# EAGLE schematic BKU (EAGLE 9.4.2)
ESKD_DESCRIPTION1: 207|235|224|242|224|32|193|209|202|49; ESKD_DESCRIPTION2: 241|245|229|236|224|32|253|235|229|234|242|240|232|247|229|241|234|224|255; ESKD_DESCRIPTION3: 239|240|232|237|246|232|239|232|224|235|252|237|224|255; ESKD_NUMBER: 67|67|83|49|46|50|50|48|48|45|48|221|51; ESKD_NUMBER_SHEET: 49; ESKD_SHEETS: 49
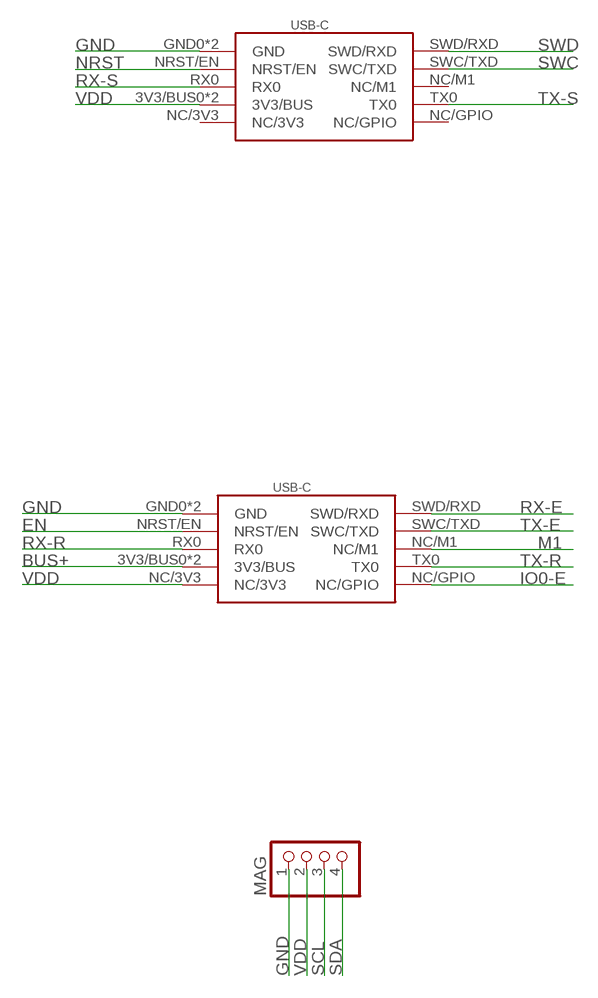
[diagram p0: schematic, sheet 1, part 1 of 2]
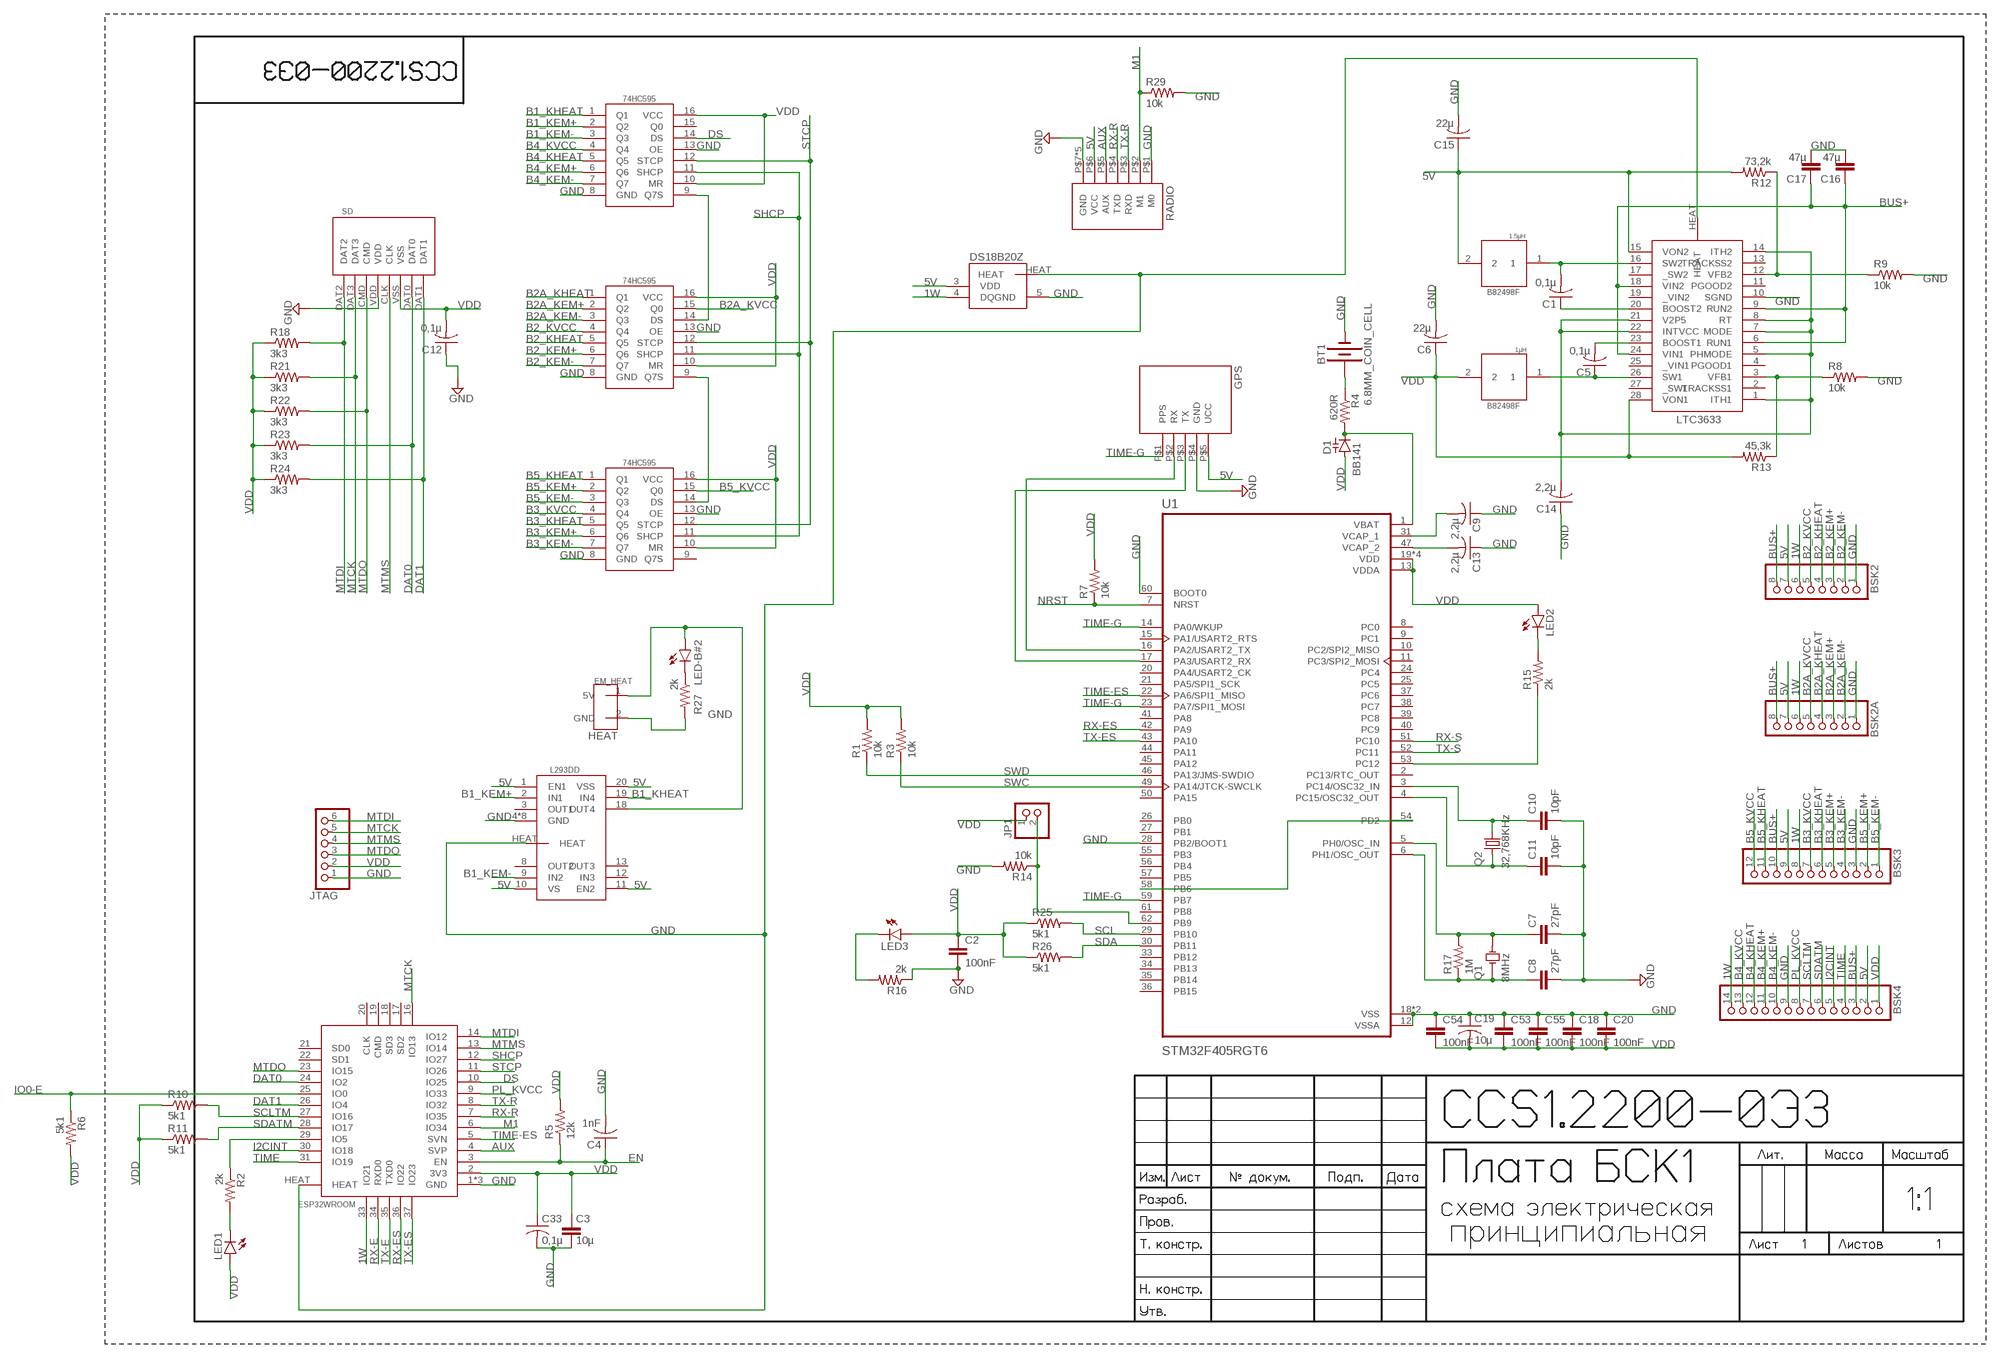
[diagram p1: schematic, sheet 1, part 2 of 2]

## Parts
BSK2  PINHD-1X8  [1X08]
BSK2A  PINHD-1X8  [1X08]
BSK3  PINHD-1X12  [1X12]
BSK4  PINHD-1X14  [1X14]
BT1  6.8MM_COIN_CELL  BATTERY-6.8MM_SMD  [BATTCON-6.8MM]
C1  0,1µ  C-USC0603  [C0603]
C2  100nF  C-EUC0603  [C0603]
C3  10µ  C-EUC1206  [C1206]
C4  1nF  C-USC0603  [C0603]
C5  0,1µ  C-USC0603  [C0603]
C6  22µ  C-USC1206  [C1206]
C7  27pF  C-EUC0603  [C0603]
C8  27pF  C-EUC0603  [C0603]
C9  2,2µ  C-USC0603  [C0603]
C10  10pF  C-EUC0603  [C0603]
C11  10pF  C-EUC0603  [C0603]
C12  0,1µ  C-USC0603  [C0603]
C13  2,2µ  C-USC0603  [C0603]
C14  2,2µ  C-USC0603  [C0603]
C15  22µ  C-USC1206  [C1206]
C16  47µ  C-EUC1210  [C1210]
C17  47µ  C-EUC1210  [C1210]
C18  100nF  C-EUC0603  [C0603]
C19  10µ  C-USC1206  [C1206]
C20  100nF  C-EUC0603  [C0603]
C33  0,1µ  C-USC0603  [C0603]
C53  100nF  C-EUC0603  [C0603]
C54  100nF  C-EUC0603  [C0603]
C55  100nF  C-EUC0603  [C0603]
D1  BB141  [SOD523]
GPS  GPSNEO6M  [GPS-NEO6M]
JP1  PINHD-1X2  [1X02]
JTAG  PINHD-1X6  [1X06]
LED1  LEDCHIPLED_0603  [CHIPLED_0603]
LED2  LEDCHIPLED_0603  [CHIPLED_0603]
LED3  LEDCHIPLED_0603  [CHIPLED_0603]
LED-B#2  LEDCHIPLED_0603  [CHIPLED_0603]
MAG  PINHD-1X4  [1X04]
Q1  8MHz  9C-8.000MEEJ-T  [XTAL_9C-8.000MEEJ-T]
Q2  32,768KHz  C005R  [C005R]
R1  10k  R-US_R0603  [R0603]
R2  2k  R-US_R0603  [R0603]
R3  10k  R-US_R0603  [R0603]
R4  620R  R-US_R0603  [R0603]
R5  12k  R-US_R0603  [R0603]
R6  5k1  R-US_R0603  [R0603]
R7  10k  R-US_R0603  [R0603]
R8  10k  R-US_R0603  [R0603]
R9  10k  R-US_R0603  [R0603]
R10  5k1  R-US_R0603  [R0603]
R11  5k1  R-US_R0603  [R0603]
R12  73,2k  R-US_R0603  [R0603]
R13  45,3k  R-US_R0603  [R0603]
R14  10k  R-US_R0603  [R0603]
R15  2k  R-US_R0603  [R0603]
R16  2k  R-US_R0603  [R0603]
R17  1M  R-US_R0603  [R0603]
R18  3k3  R-US_R0603  [R0603]
R21  3k3  R-US_R0603  [R0603]
R22  3k3  R-US_R0603  [R0603]
R23  3k3  R-US_R0603  [R0603]
R24  3k3  R-US_R0603  [R0603]
R25  5k1  R-US_R0603  [R0603]
R26  5k1  R-US_R0603  [R0603]
R27  2k  R-US_R0603  [R0603]
R29  10k  R-US_R0603  [R0603]
RADIO  RADIO  [RADIO]
SD  SD  [SD]
U1  STM32F405RGT6  [QFP50P1200X1200X160-64N]
U$4  USB-C  [USB-C]
U$5  DS18B20Z  [DS18B20Z]
U$6  USB-C  [USB-C]
U$7  EM_HEAT  [EM_HEAT]
U$8  L293DD  [L293DD]
U$10  LTC3633  [LTC3633]
U$11  1µH  B82498F  [B82498F]
U$12  B82498F  [B82498F]
U$13  ESP32WROOM  [ESP32WROOM]
U$18  74HC595  [74HC595]
U$19  74HC595  [74HC595]
U$20  74HC595  [74HC595]

## Nets
1W: BSK2.6 BSK2A.6 BSK3.8 BSK4.14 U$5.4(DQ) U$13.33(IO21)
5V: BSK2.7 BSK2A.7 BSK3.9 BSK4.2 C15.1 GPS.P$5(UCC) R12.2 RADIO.P$6(VCC) U$5.3(VDD) U$8.1(EN1) U$8.10(VS) U$8.11(EN2) U$8.20(VSS) U$10.15(VON2) U$12.2
AUX: RADIO.P$5(AUX) U$13.4(SVP)
B1_KEM+: U$8.2(IN1) U$18.2(Q2)
B1_KEM-: U$8.9(IN2) U$18.3(Q3)
B1_KHEAT: U$8.19(IN4) U$18.1(Q1)
B2_KEM+: BSK2.3 U$19.6(Q6)
B2_KEM-: BSK2.2 U$19.7(Q7)
B2_KHEAT: BSK2.4 U$19.5(Q5)
B2_KVCC: BSK2.5 U$19.4(Q4)
B2A_KEM+: BSK2A.3 U$19.2(Q2)
B2A_KEM-: BSK2A.2 U$19.3(Q3)
B2A_KHEAT: BSK2A.4 U$19.1(Q1)
B2A_KVCC: BSK2A.5 U$19.15(Q0)
B3_KEM+: BSK3.5 U$20.6(Q6)
B3_KEM-: BSK3.4 U$20.7(Q7)
B3_KHEAT: BSK3.6 U$20.5(Q5)
B3_KVCC: BSK3.7 U$20.4(Q4)
B4_KEM+: BSK4.11 U$18.6(Q6)
B4_KEM-: BSK4.10 U$18.7(Q7)
B4_KHEAT: BSK4.12 U$18.5(Q5)
B4_KVCC: BSK4.13 U$18.4(Q4)
B5_KEM+: BSK3.2 U$20.2(Q2)
B5_KEM-: BSK3.1 U$20.3(Q3)
B5_KHEAT: BSK3.11 U$20.1(Q1)
B5_KVCC: BSK3.12 U$20.15(Q0)
BUS+: BSK2.8 BSK2A.8 BSK3.10 BSK4.3 C16.1 C17.1 U$6.3V3/BUS0(3V3/BUS) U$6.3V3/BUS1(3V3/BUS) U$10.6(RUN1) U$10.9(RUN2) U$10.18(VIN2) U$10.24(VIN1)
DAT0: R23.2 SD.DAT0 U$13.24(IO2)
DAT1: R24.2 SD.DAT1 U$13.26(IO4)
DS: U$13.10(IO25) U$18.14(DS)
EN: C4.1 R5.1 U$6.NRST/EN U$13.3(EN)
GND: BSK2.1 BSK2A.1 BSK3.3 BSK4.9 BT1.- C2.2 C3.2 C4.2 C6.2 C7.2 C8.2 C9.1 C10.2 C11.2 C12.1 C13.1 C14.1 C15.2 C16.2 C17.2 C18.1 C19.1 C20.1 C33.2 C53.1 C54.1 C55.1 GPS.P$4(GND) JTAG.1 MAG.1 R8.2 R9.2 R14.2 R16.1 R27.2 R29.2 RADIO.P$1(M0) RADIO.P$7(GND) RADIO.P$9(GND) RADIO.P$15(GND) RADIO.P$16(GND) RADIO.P$17(GND) SD.VDD U1.12(VSSA) U1.18(VSS) U1.28(PB2/BOOT1) U1.60(BOOT0) U1.63(VSS) U$4.GND0(GND) U$4.GND1(GND) U$5.5(GND) U$5.HEAT U$6.GND0(GND) U$6.GND1(GND) U$7.2(GND) U$8.4(GND) U$8.5(GND) U$8.6(GND) U$8.7(GND) U$8.14(GND) U$8.15(GND) U$8.16(GND) U$8.17(GND) U$8.HEAT U$10.10(SGND) U$10.HEAT U$13.1(GND) U$13.15(GND) U$13.38(GND) U$13.HEAT U$18.8(GND) U$18.13(OE) U$19.8(GND) U$19.13(OE) U$20.8(GND) U$20.13(OE)
I2CINT: BSK4.5 U$13.30(IO18)
IO0-E: R6.1 U$6.NC/GPIO U$13.25(IO0)
IO1: R2.1 U$13.29(IO5)
M1: R29.1 RADIO.P$2(M1) U$6.NC/M1 U$13.6(IO34)
MTCK: JTAG.5 R21.2 SD.DAT3 U$13.16(IO13)
MTDI: JTAG.6 R18.2 SD.DAT2 U$13.14(IO12)
MTDO: JTAG.3 R22.2 SD.CMD U$13.23(IO15)
MTMS: JTAG.4 SD.CLK U$13.13(IO14)
N$1: BT1.+ R4.1
N$2: D1.C R4.2 U1.1(VBAT)
N$3: LED-B#2.A U$7.1(5V) U$8.18(OUT4)
N$4: LED1.C R2.2
N$5: JP1.2 R14.1 U1.62(PB9)
N$6: U1.54(PD2) U1.58(PB6)
N$7: C9.2 U1.31(VCAP_1)
N$8: C13.2 U1.47(VCAP_2)
N$15: C8.1 Q1.1 R17.1 U1.6(PH1/OSC_OUT)
N$17: U$18.9(Q7S) U$19.14(DS)
N$18: U$19.9(Q7S) U$20.14(DS)
N$24: C14.2 U$10.1(ITH1) U$10.5(PHMODE) U$10.7(MODE) U$10.8(RT) U$10.14(ITH2) U$10.21(V2P5) U$10.22(INTVCC)
N$25: R8.1 R13.1 U$10.3(VFB1)
N$28: C5.1 U$10.26(SW1) U$11.1
N$30: C7.1 Q1.2 R17.2 U1.5(PH0/OSC_IN)
N$31: C5.2 U$10.23(BOOST1)
N$32: C1.1 U$10.20(BOOST2)
N$33: C1.2 U$10.16(SW2) U$12.1
N$34: C10.1 Q2.P$2 U1.3(PC14/OSC32_IN)
N$35: C11.1 Q2.P$1 U1.4(PC15/OSC32_OUT)
N$37: LED2.C R15.2
N$38: R15.1 U1.53(PC12)
N$39: R9.1 R12.1 U$10.12(VFB2)
N$40: LED3.C R16.2
N$41: GPS.P$2(RX) U1.16(PA2/USART2_TX)
N$42: GPS.P$3(TX) U1.17(PA3/USART2_RX)
N$51: LED-B#2.C R27.1
NRST: R7.1 U1.7(NRST) U$4.NRST/EN
PL_KVCC: BSK4.8 U$13.9(IO33)
RX-E: U$6.SWD/RXD U$13.34(RXD0)
RX-ES: U1.42(PA9) U$13.36(IO22)
RX-R: RADIO.P$4(TXD) U$6.RX0 U$13.7(IO35)
RX-S: U1.51(PC10) U$4.RX0
SCL: MAG.3 R25.2 U1.29(PB10)
SCLTM: BSK4.7 R10.2 U$13.27(IO16)
SDA: MAG.4 R26.2 U1.30(PB11)
SDATM: BSK4.6 R11.2 U$13.28(IO17)
SHCP: U$13.12(IO27) U$18.11(SHCP) U$19.11(SHCP) U$20.11(SHCP)
STCP: U$13.11(IO26) U$18.12(STCP) U$19.12(STCP) U$20.12(STCP)
SWC: R3.1 U1.49(PA14/JTCK-SWCLK) U$4.SWC/TXD
SWD: R1.1 U1.46(PA13/JMS-SWDIO) U$4.SWD/RXD
TIME: BSK4.4 U$13.31(IO19)
TIME-ES: U1.22(PA6/SPI1_MISO) U$13.5(SVN)
TIME-G: GPS.P$1(PPS) U1.14(PA0/WKUP) U1.23(PA7/SPI1_MOSI) U1.59(PB7)
TX-E: U$6.SWC/TXD U$13.35(TXD0)
TX-ES: U1.43(PA10) U$13.37(IO23)
TX-R: RADIO.P$3(RXD) U$6.TX0 U$13.8(IO32)
TX-S: U1.52(PC11) U$4.TX0
VDD: BSK4.1 C2.1 C3.1 C6.1 C12.2 C18.2 C19.2 C20.2 C33.1 C53.2 C54.2 C55.2 D1.A JP1.1 JTAG.2 LED1.A LED2.A LED3.A MAG.2 R1.2 R3.2 R5.2 R6.2 R7.2 R10.1 R11.1 R13.2 R18.1 R21.1 R22.1 R23.1 R24.1 R25.1 R26.1 SD.VSS U1.13(VDDA) U1.19(VDD) U1.32(VDD) U1.48(VDD) U1.64(VDD) U$4.3V3/BUS0(3V3/BUS) U$4.3V3/BUS1(3V3/BUS) U$6.NC/3V3 U$10.28(VON1) U$11.2 U$13.2(3V3) U$18.10(MR) U$18.16(VCC) U$19.10(MR) U$19.16(VCC) U$20.10(MR) U$20.16(VCC)
Unconnected: U1.2(PC13/RTC_OUT) U1.8(PC0) U1.9(PC1) U1.10(PC2/SPI2_MISO) U1.11(PC3/SPI2_MOSI) U1.15(PA1/USART2_RTS) U1.20(PA4/USART2_CK) U1.21(PA5/SPI1_SCK) U1.24(PC4) U1.25(PC5) U1.26(PB0) U1.27(PB1) U1.33(PB12) U1.34(PB13) U1.35(PB14) U1.36(PB15) U1.37(PC6) U1.38(PC7) U1.39(PC8) U1.40(PC9) U1.41(PA8) U1.44(PA11) U1.45(PA12) U1.50(PA15) U1.55(PB3) U1.56(PB4) U1.57(PB5) U1.61(PB8) U$4.NC/3V3 U$4.NC/GPIO U$4.NC/M1 U$8.3(OUT1) U$8.8(OUT2) U$8.12(IN3) U$8.13(OUT3) U$10.2(TRACKSS1) U$10.4(PGOOD1) U$10.11(PGOOD2) U$10.13(TRACKSS2) U$10.17(_SW2) U$10.19(_VIN2) U$10.25(_VIN1) U$10.27(_SW1) U$13.17(SD2) U$13.18(SD3) U$13.19(CMD) U$13.20(CLK) U$13.21(SD0) U$13.22(SD1) U$18.15(Q0) U$20.9(Q7S)

## Notes on the sheet
- 1.5µH
- 1µH
- HEAT

## Library data of the parts
BSK2 BSK2A = pinheadCS:PINHD-1X8: PIN HEADER
BSK3 = pinheadCS:PINHD-1X12: PIN HEADER
BSK4 = pinheadCS:PINHD-1X14: PIN HEADER
BT1 = SparkFun-Batteries:BATTERY: Battery - Single Cell A variety of battery chemistries, sizes, and footprints. Device List: 20MM_PTH - Coin Cell Battery Holder - 20mm (PTH) <https://www.sparkfun.com/products/783> 20MM_PTH_KIT- Coin Cell battery Holder - 20 mm (PTH) <http://www.sparkfun.com/products/783>kit version with special mask 6.8MM_PTH - Coin Cell Battery Holder - 6.8MM(SMD) <https://www.digikey.com/product-detail/en/seiko-instruments/MS621FE-FL11E/728-1057-ND/1889208?WT.srch=1&gclid=CNOQ5a6LzdQCFZS2wAodXCkE0g> 12MM_SMD - Coin Cell Battery Holder - 12mm (SMD) <https://www.sparkfun.com/products/10592> 12MM_PTH - Coin Cell Battery Holder - 12mm (PTH) <https://www.sparkfun.com/products/7948> 20MM_SMD - 20mm Coin Cell Battery Holder (SMD) (2 legs) Used on the Big Time Watch Kit <https://www.sparkfun.com/products/11734> 20MM_SMD_4LEGS - Coin Cell Battery Holder - 20mm (SMD) <https://www.sparkfun.com/products/11892> 20MM_SMD_4LEGS_OVERPASTE - Coin Cell Battery Holder - 20mm (SMD) <https://www.sparkfun.com/products/11892> (Over-paste on the legs) 24.5MM_PTH - Coin Cell Battery Holder - 24.5mm (PTH) <https://www.sparkfun.com/products/8863> 9V - 9V Battery Holder - PC Mount Used on the SparkFun SparkPunk Sound Kit <https://www.sparkfun.com/products/11177> and SparkFun SparkPunk Sequencer Kit <https://www.sparkfun.com/products/12707> 18650 - Battery Holder - 18650 (PTH) <https://www.sparkfun.com/products/13113> AA - Battery Holder - 1xAA (PTH) <https://www.sparkfun.com/products/7949> AAA - Battery Holder - 1xAAA (PTH) <https://www.sparkfun.com/products/12718> AA_KIT - Battery Holder - 1xAA (PTH) <https://www.sparkfun.com/products/7949> Special kit package - pads only have exposed copper on one side of the board. AAA_KIT - Battery Holder - 1xAAA (PTH) <https://www.sparkfun.com/products/12718> Special kit package - pads only have exposed copper on one side of the board.; PROD_ID: BATT-13734
C1 C4-C6 C9 C12-C15 C19 C33 = rcl:C-US: CAPACITOR, American symbol; SPICEPREFIX: C
C2 C3 C7 C8 C10 C11 C16-C18 C20 C53-C55 = rcl:C-EU: CAPACITOR, European symbol; SPICEPREFIX: C
D1 = diode:BB141: Capacity DIODE variable-capacitance diode
GPS = CanCubeSat:GPS
JP1 = pinheadCS:PINHD-1X2: PIN HEADER
JTAG = pinheadCS:PINHD-1X6: PIN HEADER
LED1-LED3 LED-B#2 = led:LED: LED OSRAM: - CHIPLED LG R971, LG N971, LY N971, LG Q971, LY Q971, LO R971, LY R971 LH N974, LH R974 LS Q976, LO Q976, LY Q976 LO Q996 - Hyper CHIPLED LW Q18S LB Q993, LB Q99A, LB R99A - SideLED LS A670, LO A670, LY A670, LG A670, LP A670 LB A673, LV A673, LT A673, LW A673 LH A674 LY A675 LS A676, LA A676, LO A676, LY A676, LW A676 LS A679, LY A679, LG A679 - Hyper Micro SIDELED® LS Y876, LA Y876, LO Y876, LY Y876 LT Y87S - SmartLED LW L88C, LW L88S LB L89C, LB L89S, LG L890 LS L89K, LO L89K, LY L89K LS L896, LA L896, LO L896, LY L896 - TOPLED LS T670, LO T670, LY T670, LG T670, LP T670 LSG T670, LSP T670, LSY T670, LOP T670, LYG T670 LG T671, LOG T671, LSG T671 LB T673, LV T673, LT T673, LW T673 LH T674 LS T676, LA T676, LO T676, LY T676, LB T676, LH T676, LSB T676, LW T676 LB T67C, LV T67C, LT T67C, LS T67K, LO T67K, LY T67K, LW E67C LS E67B, LA E67B, LO E67B, LY E67B, LB E67C, LV E67C, LT E67C LW T67C LS T679, LY T679, LG T679 LS T770, LO T770, LY T770, LG T770, LP T770 LB T773, LV T773, LT T773, LW T773 LH T774 LS E675, LA E675, LY E675, LS T675 LS T776, LA T776, LO T776, LY T776, LB T776 LHGB T686 LT T68C, LB T68C - Hyper Mini TOPLED® LB M676 - Mini TOPLED Santana® LG M470 LS M47K, LO M47K, LY M47K Source: http://www.osram.convergy.de LUXEON: - LUMILED® LXK2-PW12-R00, LXK2-PW12-S00, LXK2-PW14-U00, LXK2-PW14-V00 LXK2-PM12-R00, LXK2-PM12-S00, LXK2-PM14-U00 LXK2-PE12-Q00, LXK2-PE12-R00, LXK2-PE12-S00, LXK2-PE14-T00, LXK2-PE14-U00 LXK2-PB12-K00, LXK2-PB12-L00, LXK2-PB12-M00, LXK2-PB14-N00, LXK2-PB14-P00, LXK2-PB14-Q00 LXK2-PR12-L00, LXK2-PR12-M00, LXK2-PR14-Q00, LXK2-PR14-R00 LXK2-PD12-Q00, LXK2-PD12-R00, LXK2-PD12-S00 LXK2-PH12-R00, LXK2-PH12-S00 LXK2-PL12-P00, LXK2-PL12-Q00, LXK2-PL12-R00 Source: www.luxeon.com KINGBRIGHT: KA-3528ASYC Source: www.kingbright.com
MAG = pinheadCS:PINHD-1X4: PIN HEADER
Q1 = 9C-8.000MEEJ-T:9C-8.000MEEJ-T: Crystal, 8mhz, 18pf, Hc-49s; AVAILABILITY: Unavailable; DESCRIPTION: Crystal, 8mhz, 18pf, Hc-49s; MF: TXC CORPORATION; MP: 9C-8.000MEEJ-T; PACKAGE: HC49/US TXC; PRICE: None
Q2 = CanCubeSat:C005R
R1-R18 R21-R27 R29 = resistor:R-US_: RESISTOR, American symbol
RADIO = CanCubeSat:RADIO
SD = CanCubeSat:SD
U1 = STM32F405RGT6:STM32F405RGT6: High-performance foundation line, ARM Cortex-M4 core with DSP and FPU, 1 Mbyte Flash, 168 MHz CPU, ART Accelerator; DESCRIPTION: High-performance foundation line, ARM Cortex-M4 core with DSP and FPU, 1 Mbyte Flash, 168 MHz CPU, ART Accelerator; DIGI-KEY_PART_NUMBER: 497-11767-ND; DIGI-KEY_PURCHASE_URL: https://www.digikey.com/product-detail/en/stmicroelectronics/STM32F405RGT6/497-11767-ND/2754208?utm_source=snapeda&utm_medium=aggregator&utm_campaign=symbol; MF: STMicroelectronics; MP: STM32F405RGT6; PACKAGE: LQFP-64 STMicroelectronics
U$4 U$6 = CanCubeSat:USB-C
U$5 = CanCubeSat:DS18B20Z
U$7 = CanCubeSat:EM_HEAT
U$8 = CanCubeSat:L293DD
U$10 = CanCubeSat:LTC3633
U$11 U$12 = CanCubeSat:B82498F
U$13 = CanCubeSat:ESP32WROOM
U$18-U$20 = CanCubeSat:74HC595